# EAGLE design Adafruit ItsyBitsy RP2040 (EAGLE 9.6.2)
COMPANY: ADAFRUIT INDUSTRIES; DRAWN: KTOWN; REV: B
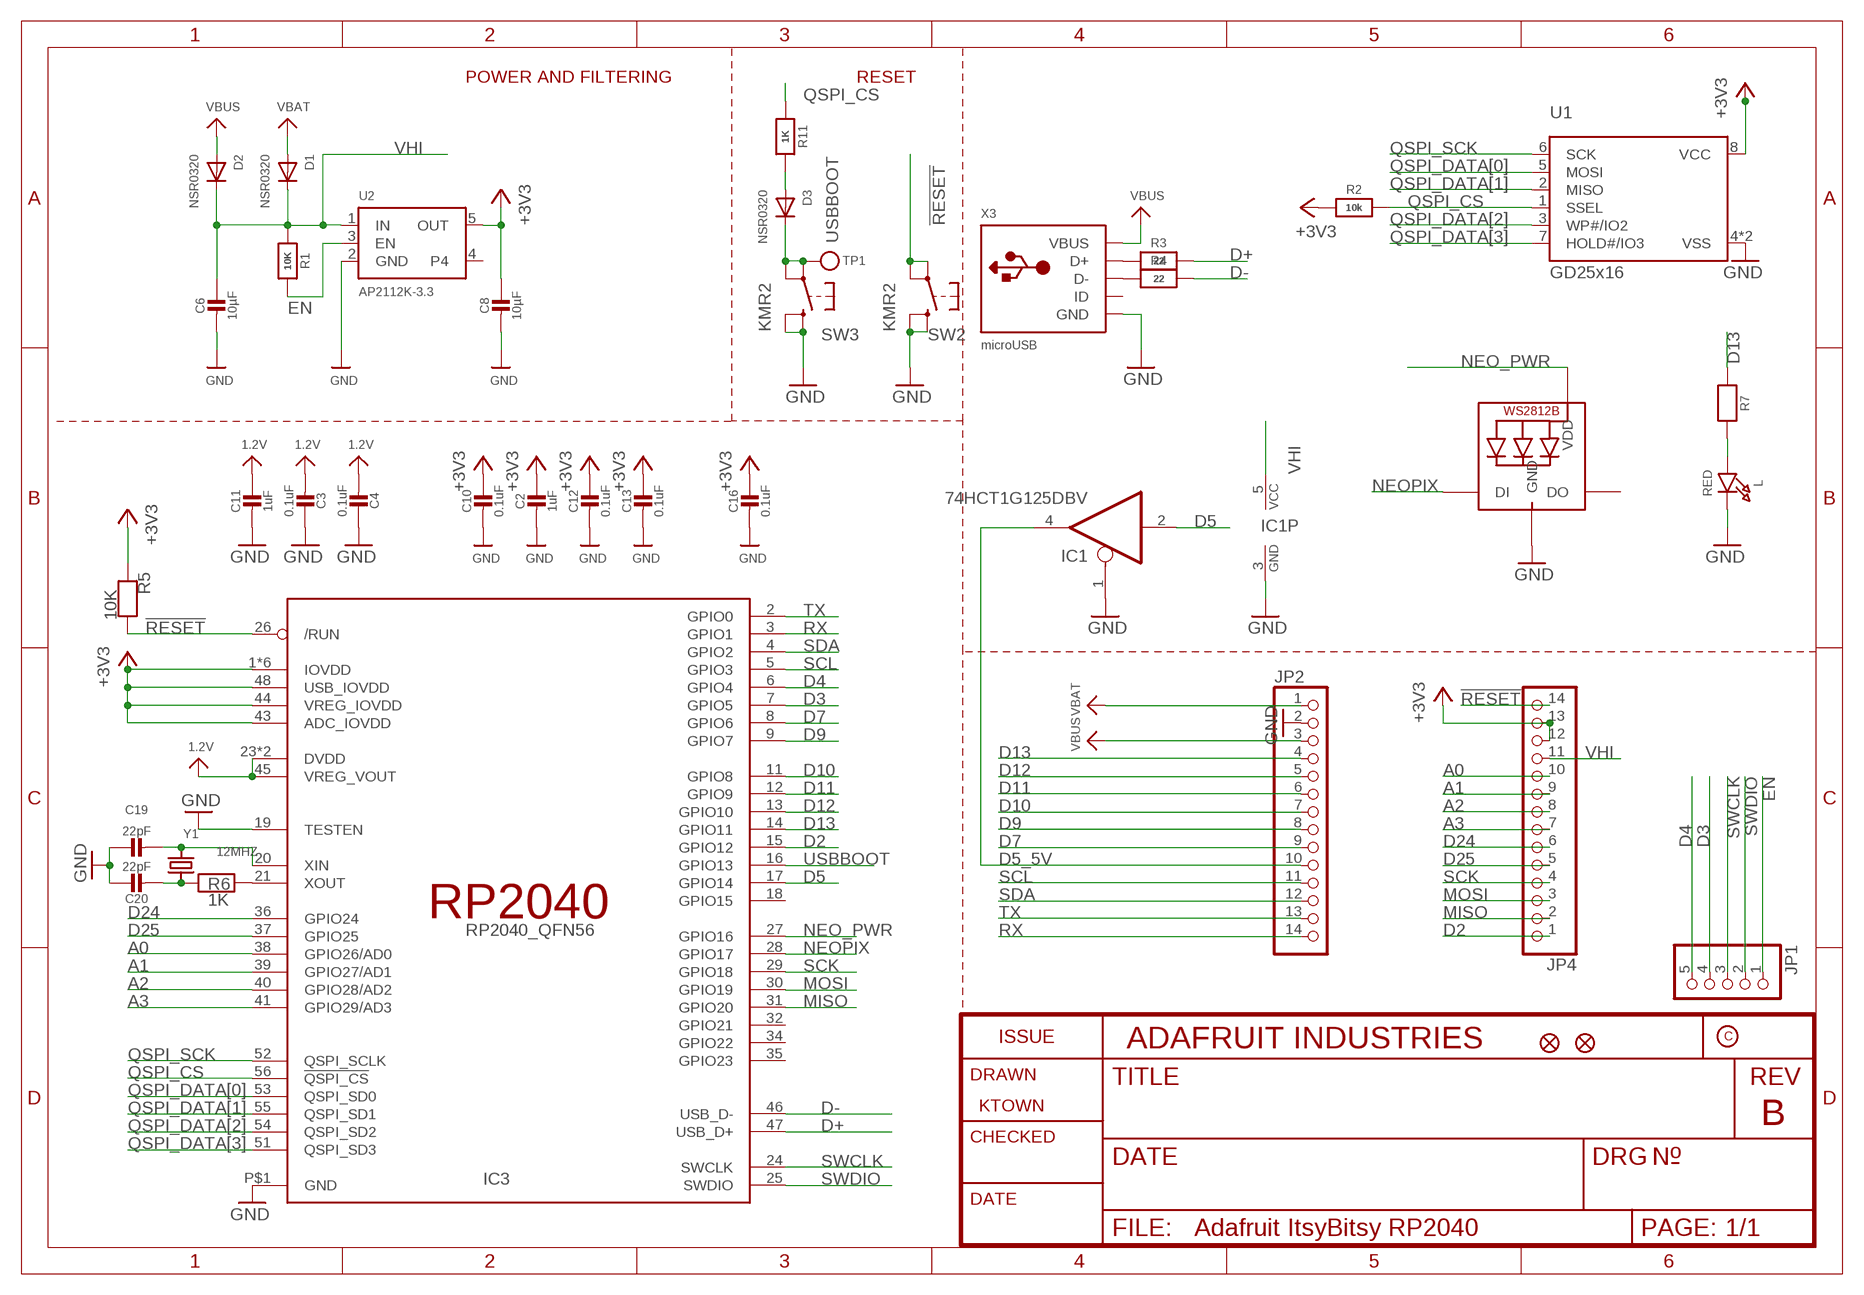
[diagram p0: schematic, sheet 1]

## Parts
C2  1uF  CAP_CERAMIC_0603MP  [_0603MP]
C3  0.1uF  CAP_CERAMIC_0402NO  [_0402NO]
C4  0.1uF  CAP_CERAMIC_0402NO  [_0402NO]
C6  10µF  CAP_CERAMIC0805-NOOUTLINE  [0805-NO]
C8  10µF  CAP_CERAMIC0805-NOOUTLINE  [0805-NO]
C10  0.1uF  CAP_CERAMIC_0402NO  [_0402NO]
C11  1uF  CAP_CERAMIC_0603MP  [_0603MP]
C12  0.1uF  CAP_CERAMIC_0402NO  [_0402NO]
C13  0.1uF  CAP_CERAMIC_0402NO  [_0402NO]
C16  0.1uF  CAP_CERAMIC_0402NO  [_0402NO]
C19  22pF  CAP_CERAMIC_0402NO  [_0402NO]
C20  22pF  CAP_CERAMIC_0402NO  [_0402NO]
D1  NSR0320  DIODESOD-323F  [SOD-323F]
D2  NSR0320  DIODESOD-323F  [SOD-323F]
D3  NSR0320  DIODESOD-323F  [SOD-323F]
IC1  74HCT1G125DBV  74AHC1G125DCK  [SC70-5]
IC3  RP2040_QFN56  [QFN56_7MM_REDUCEDEPAD]
JP1  HEADER-1X570MIL  [1X05_ROUND_70]
JP2  HEADER-1X14  [1X14_ROUND70]
JP4  HEADER-1X14  [1X14_ROUND70]
L  RED  LED0603_NOOUTLINE  [CHIPLED_0603_NOOUTLINE]
LED1  WS2812B_SK6805_1515  [SK6805_1515]
R1  10K  RESISTOR_0402NO  [_0402NO]
R2  10k  RESISTOR_0402NO  [_0402NO]
R3  22  RESISTOR_0402NO  [_0402NO]
R4  22  RESISTOR_0402NO  [_0402NO]
R5  10K  RESISTOR_0402NO  [_0402NO]
R6  1K  RESISTOR_0402NO  [_0402NO]
R7  1K  RESISTOR_0402NO  [_0402NO]
R11  1K  RESISTOR_0402NO  [_0402NO]
SW2  KMR2  SWITCH_TACT_SMT4.6X2.8  [BTN_KMR2_4.6X2.8]
SW3  KMR2  SWITCH_TACT_SMT4.6X2.8  [BTN_KMR2_4.6X2.8]
TP1  TESTPOINTROUND1.5MMNO  [TESTPOINT_ROUND_1.5MM_NO]
U1  GD25x16  SPIFLASH_8PIN_4X4  [USON8_4X4]
U2  AP2112K-3.3  VREG_SOT23-5  [SOT23-5]
U$34  FIDUCIAL_1MM  [FIDUCIAL_1MM]
U$35  FIDUCIAL_1MM  [FIDUCIAL_1MM]
X3  microUSB  USB_MICRO_NARROW  [4UCONN_20329_NARROW]
Y1  12MHZ  CRYSTAL2.5X2.0  [CRYSTAL_2.5X2]

## Nets
1.2V: C3.2 C4.2 C11.1 IC3.23(DVDD) IC3.45(VREG_VOUT) IC3.50(DVDD)
!RESET: IC3.26(/RUN) JP4.14 R5.2 SW2.A'(P1) SW2.A(P)
+3V3: C2.1 C8.1 C10.1 C12.1 C13.1 C16.1 IC3.1(IOVDD) IC3.10(IOVDD) IC3.22(IOVDD) IC3.33(IOVDD) IC3.42(IOVDD) IC3.43(ADC_IOVDD) IC3.44(VREG_IOVDD) IC3.48(USB_IOVDD) IC3.49(IOVDD) JP4.12 JP4.13 R2.1 R5.1 U1.8(VCC) U2.5(OUT)
A0: IC3.38(GPIO26/AD0) JP4.10
A1: IC3.39(GPIO27/AD1) JP4.9
A2: IC3.40(GPIO28/AD2) JP4.8
A3: IC3.41(GPIO29/AD3) JP4.7
D2: IC3.15(GPIO12) JP4.1
D3: IC3.7(GPIO5) JP1.4
D4: IC3.6(GPIO4) JP1.5
D5: IC1.2(I) IC3.17(GPIO14)
D5_5V: IC1.4(O) JP2.10
D7: IC3.8(GPIO6) JP2.9
D9: IC3.9(GPIO7) JP2.8
D10: IC3.11(GPIO8) JP2.7
D11: IC3.12(GPIO9) JP2.6
D12: IC3.13(GPIO10) JP2.5
D13: IC3.14(GPIO11) JP2.4 R7.1
D24: IC3.36(GPIO24) JP4.6
D25: IC3.37(GPIO25) JP4.5
D+: IC3.47(USB_D+) R3.2
D-: IC3.46(USB_D-) R4.2
EN: JP1.1 R1.2 U2.3(EN)
GND: C2.2 C3.1 C4.1 C6.2 C8.2 C10.2 C11.2 C12.2 C13.2 C16.2 C19.1 C20.1 IC1.1(OE) IC1.3(GND) IC3.19(TESTEN) IC3.P$1(GND) JP2.2 L.C LED1.4(GND) SW2.B'(S1) SW2.B(S) SW3.B'(S1) SW3.B(S) U1.4(VSS) U1.PAD(VSS) U2.2(GND) X3.BASE@1(GND) X3.BASE@2(GND) X3.GND X3.SPRT@1(GND) X3.SPRT@2(GND) X3.SPRT@3(GND) X3.SPRT@4(GND)
MISO: IC3.31(GPIO20) JP4.2
MOSI: IC3.30(GPIO19) JP4.3
N$1: R3.1 X3.D+
N$2: L.A R7.2
N$3: R4.1 X3.D-
N$4: D3.A R11.2
N$5: C19.2 IC3.20(XIN) Y1.3
N$6: C20.2 R6.1 Y1.1
N$7: IC3.21(XOUT) R6.2
NEO_PWR: IC3.27(GPIO16) LED1.2(VDD)
NEOPIX: IC3.28(GPIO17) LED1.1(DI)
QSPI_CS: IC3.56(!QSPI_CS) R2.2 R11.1 U1.1(SSEL)
QSPI_DATA[0]: IC3.53(QSPI_SD0) U1.5(MOSI)
QSPI_DATA[1]: IC3.55(QSPI_SD1) U1.2(MISO)
QSPI_DATA[2]: IC3.54(QSPI_SD2) U1.3(WP#/IO2)
QSPI_DATA[3]: IC3.51(QSPI_SD3) U1.7(HOLD#/IO3)
QSPI_SCK: IC3.52(QSPI_SCLK) U1.6(SCK)
RX: IC3.3(GPIO1) JP2.14
SCK: IC3.29(GPIO18) JP4.4
SCL: IC3.5(GPIO3) JP2.11
SDA: IC3.4(GPIO2) JP2.12
SWCLK: IC3.24(SWCLK) JP1.3
SWDIO: IC3.25(SWDIO) JP1.2
TX: IC3.2(GPIO0) JP2.13
USBBOOT: D3.C IC3.16(GPIO13) SW3.A'(P1) SW3.A(P) TP1.P$1
VBAT: D1.A JP2.1
VBUS: D2.A JP2.3 X3.VBUS
VHI: C6.1 D1.C D2.C IC1.5(VCC) JP4.11 R1.1 U2.1(IN)
Unconnected: IC3.18(GPIO15) IC3.32(GPIO21) IC3.34(GPIO22) IC3.35(GPIO23) LED1.3(DO) U2.4 X3.ID

## Notes on the sheet
- POWER AND FILTERING | RESET

## Library data of the parts
C2-C4 C6 C8 C10-C13 C16 C19 C20 = microbuilder:CAP_CERAMIC: Ceramic Capacitors For new designs, use the packages preceded by an '_' character since they are more reliable: The following footprints should be used on most boards: _0402 - Standard footprint for regular board layouts _0603 - Standard footprint for regular board layouts _0805 - Standard footprint for regular board layouts _1206 - Standard footprint for regular board layouts For extremely tight-pitch boards where space is at a premium, the following 'micro-pitch' footprints can be used (smaller pads, no silkscreen outline, etc.): _0402MP - Micro-pitch footprint for very dense/compact boards _0603MP - Micro-pitch footprint for very dense/compact boards _0805MP - Micro-pitch footprint for very dense/compact boards _1206MP - Micro-pitch footprint for very dense/compact boards
D1-D3 = adafruit:DIODE: Diode SMADIODE - SMA Surface Mount Package 20V 1A Schottky Diode Digikey: 641-1014-6-ND DO-1N4148 - Through Hole Small Current Diode SOD-123 20V 1 A (.5mV Vf) Schottky Diode - Digikey: MBRX120TPMSCT-ND SOD-323 10V 570mA (.38mV Vf, 3ns) Schottky Diode - Digikey: ZLLS410CT-ND SOD-523 30V 30mA Schottky Diode (RB751S-40TE61) - Digikey: RB751S-40TE61CT-ND SOT23-R/W - SOT23 Package (R = Solder Paste/Reflow Ovens, W = Hand-Soldering) BAT54Film 40V 300mA - Digikey: 497-7162-1-ND
IC1 = 74xx-little-us:74*1G125: Single Bus Buffer Gate with 3-State Output
IC3 = adafruit_micro:RP2040
JP1 = microbuilder:HEADER-1X5: PIN HEADER
JP2 JP4 = microbuilder:HEADER-1X14
L = microbuilder:LED: LED 0603 - 0603 Surface Mount Package 2mA: Green LED - Low Power (3.9mcd, 2ma, 1.7Vf) - Digikey: 475-2709-2-ND Orange LED - Low Power (9.8mcd, 2ma, 1.8Vf) - Digikey: 475-1194-2-ND Red LED - Low Power (5mcd, 2ma, 1.8Vf) - Digikey: 475-1195-2-ND Yellow LED - Low Power (7mcd, 2ma, 1.8Vf) - Digikey: 475-1196-2-ND 5mA: Blue LED - Low Power (17mcd, 5ma, 2.9Vf) - Digikey: LNJ937W8CRACT-ND 0805 - 0805 Surface Mount Package 2mA: Red LED (8.8mcd, 2mA, 1.8Vf, Clear) - Low Power [Digikey: 475-2510-1-ND] Green LED (5mcd, 2mA, 1.8Vf, Clear) - Low Power [Digikey: 475-2730-1-ND] Yellow LED (11.3mcd, 2mA, 1.8Vf, Clear) - Low Power [Digikey: 475-2555-1-ND] 20mA: Red LED (104mcd, 20mA, Diffused) - LS R976 [Digikey: 475-1278-6-ND] Red LED (12mcd, 20mA, 2.0Vf, Clear) - APT2012EC [Digikey: 754-1128-1-ND] Green LED (15mcd, 20mA, 2.2Vf, Clear) - APT2012GC [Digikey: 754-1131-1-ND] Orange LED (160mcd, 20mA, 2.1Vf, Clear) - APT2012SECK [Digikey: 754-1130-1-ND] 1206 - 1206 Surface Mount Package Green LED (26mcd, 20mA, Diffused) - LG N971 [Digikey: 475-1407-6-ND] Red LED (15mcd, 20mA, Diffused) - LH N974 [Digikey: 475-1416-6-ND] Cree - Cree High-Power Surface Mount LEDs XPEBWT-L1-0000-00D50 - White 111lm 350mA 2.9Vf 6200K 110° XTEAWT-00-0000-00000LEE3 - White 114lm 350mA 2.85Vf 5000K 115° Everlight - Everlight 45-21 Series Surface Mount LEDs 45-21/QK2C-B2832AC2CB2/2T - Warm White 2000mcd 20mA 3.25Vf 3050K 120° 45-21/LK2C-B38452C4CB2/2T - Nuetral White 2000mcd 20mA 3.25Vf 4150K 120° 45-21/LK2C-B50634C6CB2/2T - Cold White 2200mcd 20mA 3.25Vf 5650K 120° PLCC2 Reverse Mount LS T77K-J1L2-1-0-2-R18-Z - Red 11.25mcd 2mA 1.8Vf 630nm 120° LO T77K-L1M2-24-Z - Orange 19.6mcd 2mA 1.8Vf 606nm 120° LY T77K-K2M1-26-Z - Yellow 15.7mcd 2mA 1.8Vf 587nm 120°
LED1 = microbuilder:WS2812B
R1-R7 R11 = microbuilder:RESISTOR: Resistors For new designs, use the packages preceded by an '_' character since they are more reliable: The following footprints should be used on most boards: _0402 - Standard footprint for regular board layouts _0603 - Standard footprint for regular board layouts _0805 - Standard footprint for regular board layouts _1206 - Standard footprint for regular board layouts For extremely tight-pitch boards where space is at a premium, the following 'micro-pitch' footprints can be used (smaller pads, no silkscreen outline, etc.): _0402MP - Micro-pitch footprint for very dense/compact boards _0603MP - Micro-pitch footprint for very dense/compact boards _0805MP - Micro-pitch footprint for very dense/compact boards _1206MP - Micro-pitch footprint for very dense/compact boards
SW2 SW3 = microbuilder:SWITCH_TACT_SMT: SMT Tact Switches 6x6mm - Digikey: P12940SCT-ND KMR2 (4.6x2.8mm) - Digikey: 401-1426-1-ND EVQ-PQHB55 - Light Touch, 160GF (4.5x4.5mm) - Digikey: P8090SCT-ND KMT0 - KMT021 NGJ LHS (etc.) IP68/Waterproof - Digikey: CKN10289CT-ND
TP1 = microbuilder:TESTPOINT: Test Point Various test points for characterisation and PCB testing TESTPOINT_SMT - Compact Surface Mount Test Point [Digikey: 5016KTR-ND]
U1 = microbuilder:SPIFLASH_8PIN: SOIC8 SPI Flash Be careful with the size since SOIC8 flash comes in several 'widths' SOIC8 150 mil M25P16 - 16Mbit (2Mbit x 8) Serial Flash (75MHz SPI Bus), Supply: 2.7-3.6V Digikey: SOIC8 - M25P16-VMN6P-ND SOIC8 208 mil W25Q16BVSSIG - 16Mbit (2Mbit x 8) Serial Flash (104MHz SPI Bus), Supply: 2.7-3.6V Digikey: SOIC8 - W25Q16BVSSIG-ND
U2 = microbuilder:VREG_SOT23-5: SOT23-5 Fixed Voltage Regulators Part Current Out V Out V In V Dropout θJA (°C/W) TJ (°C) Digikey Part No. ADP121 150mA 3.3V 3.4-5.5V 0.09V @ 150mA -- -- ADP121-AUJZ33R7CT-ND ADP121 150mA 3.0V 3.1-5.5V 0.09V @ 150mA -- -- ADP121-AUJZ30R7CT-ND ADP122 300mA 3.3V 3.4-5.5V 0.085V @ 300mA -- -- ADP122AUJZ-3.3-R7CT-ND ADP1712 300mA 3.3V 3.5-5.5V 0.17V @ 300mA -- -- ADP1712AUJZ-3.3-R7TR-ND AP7311 (Low Cost) 150mA 3.3V 3.5-6V 0.15V @ 150mA -- -- AP7311-33WG-7DICT-ND LD39015M18R 150mA 1.8V 1.9V-5.5V 0.08V @ 100mA -- -- 497-6977-1-ND LP2985A-33DBVR 150mA 3.3V 3.3-16V 0.28V @ 150mA 206 150 296-18479-1-ND MCP1824T-3302E/OT 300mA 3.3V 3.5V-6V 0.2V @ 300mA -- -- MCP1824T-3302E/OTCT-ND MIC5205-2.5YM5 TR 150mA 2.5V 2.7-16V 0.165V @ 150mA -- -- 576-1257-2-ND MIC5205-3.0YM5 TR 150mA 3.0V 3.2V-16V 0.165V @ 150mA -- -- 576-1258-2-ND MIC5205-3.3YM5 TR 150mA 3.3V 3.5V-16V 0.165V @ 150mA -- -- 576-1259-2-ND TPS780330220 150mA 3.3V+2.2V 3.6-5.5V 250mV Max -- -- 296-23332-1-ND TDA3663/N1,135 100mA 3.3V 3.5-45V 0.18V @ 50mA -- -- 568-5343-1-ND Max operating temp can be calculated using θJA, TJ (max junction temperature), and power in watts. Set the "Maximum Ambient Temperature" until it reaches TJ ("Max Junction Temperature"), which is the absolute limit for safe use of the regulator: Heat Sink Temperature Calculator <http://www.daycounter.com/Calculators/Heat-Sink-Temperature-Calculator.phtml> For example, With 12V source into a 3.3V LP2985 and a 30mA load, we are dissipating (12V-3.3V) * 0.03A = 0.261W. With a θJA of 206 °C/W, a TJ of 150°C, and 261mW we can safely use the chip without a heat sink up to 75°C (=147.1°C Junction Temperature).
U$34 U$35 = microbuilder:FIDUCIAL: Fiducial Alignment Points Various fiducial points for machine vision alignment.; BOM: EXCLUDE
X3 = adafruit_connector:USB: USB Connectors USBMINIB - Surface Mount Female Mini-B USB Connector 4UConnector: 06564
Y1 = microbuilder:CRYSTAL: Crystals HC49UP - Surface Mount Crystal 4.0MHz 18pF +/-30ppm Surface Mount Crystal [Digikey: 535-9857-1-ND] 12.0 MHz Surface Mount Crystal [Digikey: 535-9869-6-ND] 25.0 MHz Surface Mount Crystal [Digikey: 535-9078-1-ND] 2.5 x 2.0mm - MEMs SMT Crystal 16.0 MHz 10pF 20ppm 2.5 x 2.0mm Crystal [Digikey -40-85°C: 535-10923-1-ND] 3.2 x 2.5mm - MEMs SMT Crystal 12.0 MHz 8pF 15ppm 3.2 x 2.5mm Crystal [Digikey: -10-70°C: 644-1047-1-ND -40-125°C: 644-1128-1-ND] 40~85°C cheaper: 644-1173-6-ND 16.0 MHz 8pF 15ppm 3.2 x 2.5mm Crystal [Digikey: -10-70°C: 644-1049-1-ND -40-125°C: 644-1129-2-ND]-40~85°C cheaper: 644-1175-6-ND 16.0 MHz 10pF 10ppm 3.2 x 2.5mm Crystal [Digikey: 644-1100-1-ND] 27.12 MHz 18pF 30ppm 3.2 x 2.5mm Crystal [Digikey: 887-1424-1-ND] 27.12MHz 10pF 10ppm 3.2 x 2.5mm Crystal [Digikey: 887-1329-1-ND] 4.9 x 1.8mm - MEMs SMT Crystal 32.768 KHz 12.5pF 20ppm 4.9 x 1.8mm Crystal [Digikey: SE2415CT-ND] 8.0 x 3.8mm - Surface Mount Crystal 32.768kHz 12.5pF 20ppm -40°C-85°C [Digikey: 535-9166-2-ND] Cylinder 32.768KHz Cylinder Crystal (2x6mm body) [Ex. Digikey: 300-8341-2-ND]

## Net classes
1 power: width 0.305 mm

## Board
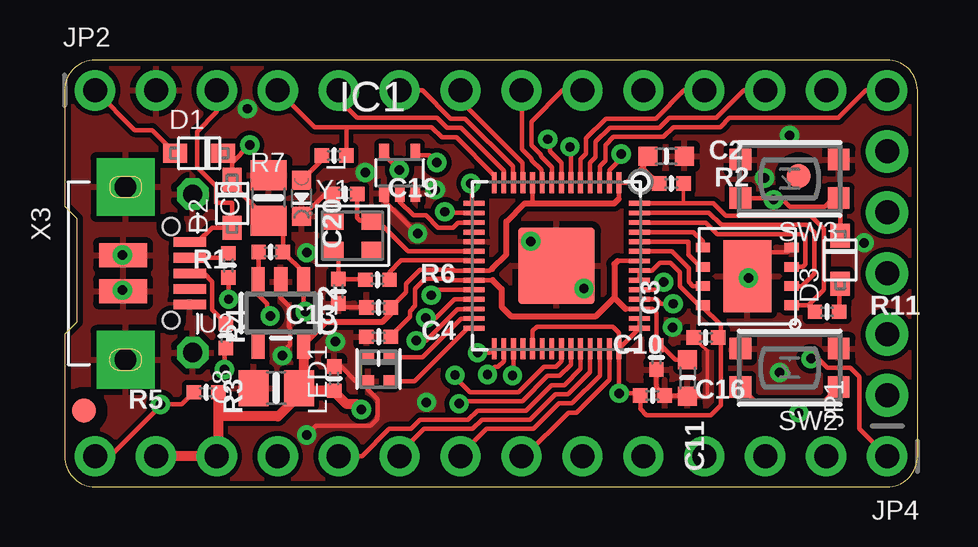
[diagram p1: board, top side]
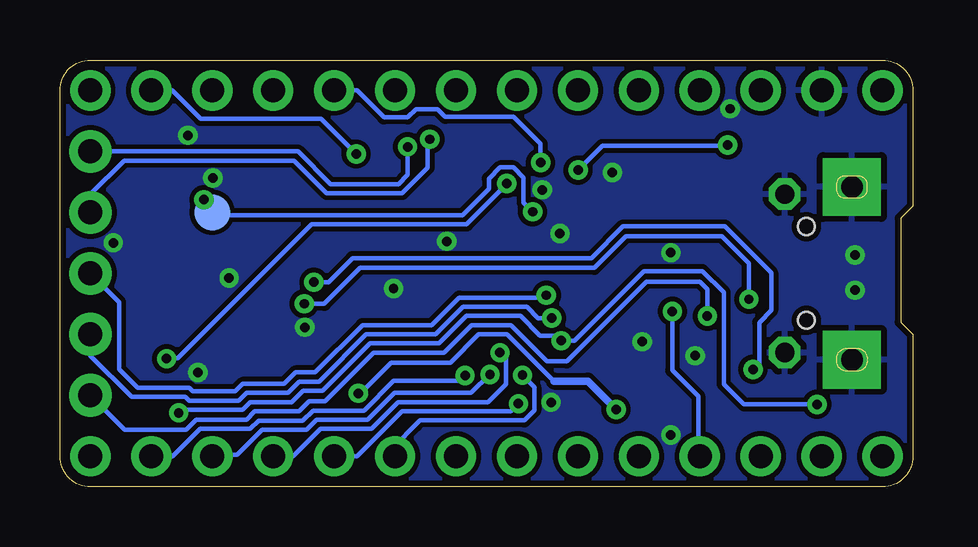
[diagram p2: board, bottom side, seen from below]

Size 35.56 x 17.78 mm. Coordinates in mm from the lower left corner, seen from the top.
Outline: 0,6.35 0,1.27 arc90 1.27,0 34.29,0 arc90 35.56,1.27 35.56,16.51 arc90 34.29,17.78 1.27,17.78 arc90 0,16.51 0,11.68 0.51,11.18 0.51,6.86 0,6.35
Copper layers (1*16): Top 0.035mm / dielectric 1.5mm / Bottom 0.035mm
Design rules "adafruit 7-7 *": minimum track width 6mil, minimum drill 15.5mil, track to track 8mil, track to pad 7mil, pad to pad 7mil, via to via 7mil, smd to smd 7mil, copper to edge 10mil, drill to drill 8mil, minimum pad ring 10mil, minimum via ring 8mil, stop-mask expansion 2mil, vias tented up to drill 20mil, thermal gap 10mil

### Footprints (pad centres in the part's own frame; a part is rotated, then mirrored left to right if it is on the bottom)
_0603MP = smd 0.8 x 0.8: 1 -0.762,0; 2 0.762,0
_0402NO = smd 0.6 x 0.6: 1 -0.508,0; 2 0.508,0
0805-NO = smd 1.24 x 1.5: 1 -0.95,0; 2 0.95,0
SOD-323F = smd 1 x 0.8: A -1,0; C 1,0
SC70-5 = smd 0.4 x 0.7: 1 -0.65,-0.85; 2 0,-0.85; 3 0.65,-0.85; 4 0.65,0.85; 5 -0.65,0.85
QFN56_7MM_REDUCEDEPAD = smd 0.875 x 0.2: 1 -3.45,2.6; 2 -3.45,2.2; 3 -3.45,1.8; 4 -3.45,1.4; 5 -3.45,1; 6 -3.45,0.6; 7 -3.45,0.2; 8 -3.45,-0.2; 9 -3.45,-0.6; 10 -3.45,-1; 11 -3.45,-1.4; 12 -3.45,-1.8; 13 -3.45,-2.2; 14 -3.45,-2.6; 29 3.45,-2.6; 30 3.45,-2.2; 31 3.45,-1.8; 32 3.45,-1.4; 33 3.45,-1; 34 3.45,-0.6; 35 3.45,-0.2; 36 3.45,0.2; 37 3.45,0.6; 38 3.45,1; 39 3.45,1.4; 40 3.45,1.8; 41 3.45,2.2; 42 3.45,2.6 | smd 0.2 x 0.875: 15 -2.6,-3.45; 16 -2.2,-3.45; 17 -1.8,-3.45; 18 -1.4,-3.45; 19 -1,-3.45; 20 -0.6,-3.45; 21 -0.2,-3.45; 22 0.2,-3.45; 23 0.6,-3.45; 24 1,-3.45; 25 1.4,-3.45; 26 1.8,-3.45; 27 2.2,-3.45; 28 2.6,-3.45; 43 2.6,3.45; 44 2.2,3.45; 45 1.8,3.45; 46 1.4,3.45; 47 1,3.45; 48 0.6,3.45; 49 0.2,3.45; 50 -0.2,3.45; 51 -0.6,3.45; 52 -1,3.45; 53 -1.4,3.45; 54 -1.8,3.45; 55 -2.2,3.45; 56 -2.6,3.45 | smd 3.2 x 3.2: P$1 0,0
1X05_ROUND_70 = drill 1 pad 1.778: 1 -5.08,0; 2 -2.54,0; 3 0,0; 4 2.54,0; 5 5.08,0
1X14_ROUND70 = drill 1 pad 1.676: 1 -16.51,0; 2 -13.97,0; 3 -11.43,0; 4 -8.89,0; 5 -6.35,0; 6 -3.81,0; 7 -1.27,0; 8 1.27,0; 9 3.81,0; 10 6.35,0; 11 8.89,0; 12 11.43,0; 13 13.97,0; 14 16.51,0
CHIPLED_0603_NOOUTLINE = smd 0.8 x 0.8: A 0,-0.75; C 0,0.75
SK6805_1515 = smd 0.5 x 0.5: 1 -0.5,-0.45; 2 0.5,-0.45; 3 0.5,0.45; 4 -0.5,0.45
BTN_KMR2_4.6X2.8 = smd 0.9 x 0.9: A 2.05,0.8; A' -2.05,0.8; B 2.05,-0.8; B' -2.05,-0.8
TESTPOINT_ROUND_1.5MM_NO = smd 1.5 x 1.5: P$1 0,0
USON8_4X4 = smd 0.6 x 0.4: 1 -1.85,1.2; 2 -1.85,0.4; 3 -1.85,-0.4; 4 -1.85,-1.2; 5 1.85,-1.2; 6 1.85,-0.4; 7 1.85,0.4; 8 1.85,1.2 | smd 2 x 3: PAD 0,0
SOT23-5 = smd 0.55 x 1.2: 1 -0.95,-1.3; 2 0,-1.3; 3 0.95,-1.3; 4 0.95,1.3; 5 -0.95,1.3
FIDUCIAL_1MM = smd 1 x 1: 1 0,0
4UCONN_20329_NARROW = smd 1 x 2: BASE@1 -0.75,-2; BASE@2 0.75,-2 | smd 0.4 x 1.35: D+ 0,0.775; D- -0.65,0.775; GND 1.3,0.775; ID 0.65,0.775; VBUS -1.3,0.775 | drill 0.8 pad 1.27 octagon: SPRT@1 -3.3,0.9; SPRT@2 3.3,0.9 | drill 0.9 pad 2.413 square: SPRT@3 -3.6,-1.9; SPRT@4 3.6,-1.9 | hole 0.7: -1.95,0; 1.95,0
CRYSTAL_2.5X2 = smd 0.9 x 0.75: 1 -0.825,-0.625; 2 0.825,-0.625; 3 0.825,0.625; 4 -0.825,0.625

### Placement (x,y rotation side)
C2  25.08,13.77 0 top
C3  24.68,5.38 90 top
C4  13.09,6.25 0 top
C6  8.51,12.03 90 top
C8  8.83,4.11 180 top
C10  26.73,6.22 180 top
C11  25.97,4.53 270 top
C12  11.24,4.51 90 top
C13  13.09,7.47 180 top
C16  24.51,3.8 0 top
C19  11.7,12.19 0 top
C20  11.42,8.14 90 top
D1  5.61,13.89 0 top
D2  6.99,11.8 90 top
D3  32.33,9.45 90 top
IC1  13.97,13.08 0 top
IC3  20.51,9.21 270 top
JP1  34.29,8.89 90 top
JP2  17.78,16.51 0 top
JP4  17.78,1.27 180 top
L  9.88,12.02 180 top
LED1  13.09,4.9 90 top
R1  8.6,9.78 180 top
R2  25.3,12.64 0 top
R3  6.73,6.29 270 top
R4  6.83,9.22 270 top
R5  5.91,3.94 180 top
R6  13.04,8.62 0 top
R7  11.24,13.8 180 top
R11  31.79,7.29 0 top
SW2  30.23,4.95 180 top
SW3  30.23,12.83 180 top
TP1  29.21,11.43 0 bottom
U1  28.46,8.76 180 top
U2  9.02,7.24 180 top
U$4  [ITSY2040_TOP]  0,0 0 top
U$5  [ITSY2040_BOT]  35.56,0 0 bottom
U$34  30.61,12.95 270 top
U$35  0.81,3.17 270 top
X3  4.45,8.89 270 top
Y1  12,10.46 0 top

### Tracks (layer width: path | path; a pad name or v marks a point on that pad's centre or on a via)
1.2V
  Top 0.152: IC3.45 24.31,7.41
  Top 0.178: IC3.50 23.06,9.41 | 23.39,7.41 IC3.45 | 17.85,8.61 IC3.23 16.09,8.61 16.04,8.66 15.03,8.66 14.62,8.26 14.62,7.53 14.39,7.3 14.39,7.09 13.6,6.3 C4.2 | 24.31,7.41 24.51,7.41 24.68,7.24 24.68,6.08 | 24.68,6.08 C3.2 | 24.68,6.08 25.46,5.3 C11.1
  Top 0.254: 23.06,9.41 22.92,9.27 22.92,7.87 | 22.92,7.87 23.39,7.41 | 22.92,7.87 22.16,7.11 18.61,7.11 18.22,7.49 18.22,8.23 17.85,8.61
!RESET  (via drill 0.39)
  Top 0.178: JP4.14 1.91,1.27 4,3.37 v4,3.43 4.89,3.43 R5.2 | IC3.26 17.04,7.39 16.38,7.39 15.07,6.08 v14.66,6.08 | 30.61,3.52 28.81,3.52 SW2.A | 30.61,3.52 31.64,3.52 SW2.A' | v30.61,3.08 30.61,3.52
  Bottom 0.178: v4,3.43 7.05,3.43 7.89,4.27 7.89,8.1 8.78,8.98 11.21,8.98 14.12,6.07 14.65,6.07 v14.66,6.08 14.88,6.3 15.54,6.3 16.36,7.12 18.6,7.12 19.75,5.97 22.64,5.97 24.61,4 25.42,4 25.9,3.52 27.63,3.52 27.94,3.21 30.48,3.21 v30.61,3.08
+3V3  (via drill 0.39)
  Top 0.152: R2.1 24.16,13.27 | C10.1 27.27,6.25 27.36,6.25
  Top 0.178: C8.1 9.78,4.19 9.97,4.19 | IC3.48 IC3.49 24.49,9.01 24.82,9.34 25.25,9.34 25.64,8.94 25.64,8.36 26.45,7.56 U1.8 26.61,7.49 27.36,6.74 27.36,6.25 27.36,3.39 26.95,2.98 24.26,2.98 24,3.24 C16.1 23.91,3.89 v23.12,3.89 23.11,3.9 IC3.42 | IC3.44 IC3.43 IC3.42 | 17.82,9.08 17.79,9.08 17.72,9.01 IC3.22 16.27,9.01 16.23,9.05 14.82,9.05 14.24,8.46 14.24,8.1 C13.1 | IC3.33 19.51,6.49 19.68,6.67 22.86,6.67 23.11,6.42 IC3.42 | 9.91,4 9.9,3.99 | 24.16,13.27 24.16,13.6 C2.1 24.32,13.55 23.43,12.66 IC3.1 23.11,12 | IC3.10 19.51,11.81
  Top 0.254: 9.9,3.99 C8.1 9.78,3.81 | 23.11,12 22.92,11.81 19.51,11.81 19.18,11.81 18.41,11.05 18.41,9.67 17.82,9.08 | C12.1 11.24,3.96 | 6.41,1.33 JP4.12 | C13.1 13.6,7.23 13.23,6.86 10.89,6.86 U2.5
  Top 0.406: JP4.12 JP4.13 | 11.24,3.96 11.76,3.44 12.15,3.44 v12.38,3.22 | R5.1 6.41,2.93 | 6.41,2.93 6.41,1.33 | 6.41,2.93 8.9,2.93 9.78,3.81 | U2.5 9.97,4.19 | C12.1 9.91,4
  Bottom 0.178: 14.96,4.4 16.91,6.35 18.1,6.35 19.28,5.17 21.75,5.17 23.03,3.89 v23.12,3.89
  Bottom 0.305: 14.96,4.4 13.56,4.4 v12.38,3.22
A0
  Top 0.178: JP4.10 12.39,1.27 13.54,2.41 14.44,2.41 14.82,2.79 16.83,2.79 17.21,3.17 19.24,3.17 20.3,4.23 20.84,4.23 21.51,4.91 IC3.38
A1
  Top 0.178: JP4.9 14.1,1.4 14.1,1.52 14.99,2.41 17.02,2.41 17.4,2.79 19.4,2.79 20.46,3.85 21,3.85 21.91,4.77 IC3.39
A2
  Top 0.178: JP4.8 16.64,1.4 16.64,1.46 17.59,2.41 19.56,2.41 20.61,3.47 21.15,3.47 22.31,4.63 IC3.40
A3
  Top 0.178: JP4.7 19.18,1.27 21,3.09 21.34,3.09 22.71,4.46 22.71,5.59 IC3.41
D2  (via drill 0.39)
  Top 0.178: v16.93,12.64 17,12.58 17,11.87 IC3.15 | JP4.1 33.13,2.43 33.13,4.57 32.75,4.95 31.8,4.95 31.42,5.33 v31.11,5.33
  Bottom 0.178: v16.93,12.64 16.93,12.61 18.61,10.93 25.07,10.93 30.66,5.35 31.1,5.35 v31.11,5.33
D3  (via drill 0.39)
  Top 0.178: IC3.7 20.71,13.5 20.23,13.98 20.23,14.39 v20.14,14.48
  Bottom 0.178: JP1.4 34.29,12.19 32.89,13.59 25.8,13.59 24.44,12.23 21.29,12.23 20.23,13.29 20.23,14.39 v20.14,14.48
D4  (via drill 0.39)
  Top 0.178: IC3.6 21.11,14.12 v21.07,14.16
  Bottom 0.178: v21.07,14.16 21.07,12.99 21.45,12.61 24.28,12.61 25.64,13.97 JP1.5
D5
  Top 0.178: IC1.2 13.97,11.87 14.54,11.3 15.06,11.3 15.58,10.79 16.19,10.79 16.41,11.01 IC3.17
D5_5V  (via drill 0.39)
  Top 0.178: v15.52,13.51 15.22,13.8 14.75,13.8 IC1.4
  Bottom 0.178: JP2.10 23.18,16.51 22.05,15.39 21.06,15.39 20.73,15.72 19.82,15.72 19.51,15.4 16.64,15.4 15.52,14.28 v15.52,13.51
D7
  Top 0.178: IC3.8 20.31,13.31 19.85,13.77 19.85,13.82 19.46,14.22 19.46,15.2 20.77,16.51 JP2.9
D9
  Top 0.178: IC3.9 19.89,12.68 19.89,13.18 19.88,13.2 19.88,13.21 19.47,13.61 19.47,13.66 19.07,14.06 19.07,16.48 JP2.8
D10
  Top 0.178: JP2.7 16.51,16.09 19.09,13.51 19.09,12.68 IC3.11
D11
  Top 0.178: IC3.12 18.69,12.68 18.69,13.34 16.69,15.34 16.09,15.34 14.92,16.51 JP2.6
D12
  Top 0.178: JP2.5 11.43,16.13 12.19,15.37 15.53,15.37 15.94,14.95 16.54,14.95 18.28,13.21 18.28,13.2 18.31,13.17 IC3.13
D13
  Top 0.178: JP2.4 10.41,14.99 11.11,14.99 11.24,14.99 11.75,14.99 | IC3.14 17.91,12.97 16.33,14.55 15.73,14.55 15.3,14.99 11.75,14.99 | R7.1 11.75,14.99
D24  (via drill 0.39)
  Top 0.178: IC3.36 20.71,5.23 20.48,5 19.98,5 18.93,3.94 16.91,3.94 16.28,4.57 v16.28,4.65
  Bottom 0.178: v16.28,4.65 15.78,4.15 15.78,3.19 16.2,2.76 20.54,2.76 20.73,2.57 21.59,1.71 JP4.6
D25  (via drill 0.39)
  Top 0.178: IC3.37 21.11,5.09 20.64,4.61 20.14,4.61 19.08,3.56 16.54,3.56 v16.45,3.46
  Bottom 0.178: v16.45,3.46 16.76,3.14 21.3,3.14 23.18,1.27 JP4.5
D+  (via drill 0.39)
  Top 0.178: v24.98,8.53 24.66,8.21 IC3.47 | R3.2 6.67,5.71 v6.67,4.89
  Bottom 0.178: v24.98,8.53 24.37,8.53 23.37,9.53 13.41,9.53 12.09,10.85 7.84,10.85 5.91,8.91 5.91,7.34 6.41,6.84 6.41,5.14 v6.67,4.89
D-  (via drill 0.39)
  Top 0.178: IC3.46 24.67,7.81 24.86,7.62 v25.38,7.62 | v6.84,7.81 v6.83,7.82 R4.2
  Bottom 0.178: v25.38,7.62 24.54,7.62 23.05,9.12 13.28,9.12 11.96,10.44 7.97,10.44 6.84,9.31 v6.84,7.81
EN  (via drill 0.39)
  Top 0.178: v8.57,7.11 8.45,7.11 8.45,7.62 8.07,8 U2.3 8.09,8.56 R1.2
  Bottom 0.178: JP1.1 32.85,2.38 30.3,2.38 29.88,2.79 27.79,2.79 27.44,3.14 25.59,3.14 25.18,3.56 24.51,3.56 22.48,5.59 19.56,5.59 18.41,6.73 16.76,6.73 15.25,5.23 14.43,5.23 11.11,8.54 8.88,8.54 8.57,8.24 v8.57,7.11
GND  (via drill 0.39)
  Top 0.152: C10.2 26.52,5.92 26.53,5.92 26.8,5.66 26.8,3.77 C11.2
  Top 0.178: IC1.1 13.32,11.91 14.68,10.55 v14.72,10.55 | C12.2 11.52,5.02 12.14,4.4 LED1.4 12.64,4.04 13.04,3.65 13.04,2.94 13.03,2.93 13.03,2.82 12.75,2.54 10.48,2.54 v10.1,2.16 | C20.1 11.58,7.47 C13.2 | v21.65,8.26 20.7,9.21 IC3.P$1 20.45,9.21 v19.43,10.22 | U2.2 9.02,7.86 9.37,7.51 9.37,6.64 9.4,6.6 9.4,5.91 9.08,5.59 v9.08,5.46 | L.C 9.93,11.27 10.86,12.19 C19.1 | U1.4 30.13,9.78 28.83,9.78 28.46,9.41 U1.PAD | C11.2 25.95,3.8 C16.2 24.68,4.14 C3.1
  other vias: 2.41,9.65 2.41,8.19 7.62,15.75 15.09,3.52 11.29,6.05 25.35,6.64 28.51,8.7 33.34,10.16 29.18,12.87 29.81,4.76 15.46,12.37 30.23,14.64 12.53,13.09 10.1,9.75
  pour Top: 0,0 35.56,0 35.56,17.78 0,17.78
  pour Bottom: 0,0 35.56,0 35.56,17.78 0,17.78
MISO  (via drill 0.39)
  Top 0.178: IC3.31 18.71,5.19 18.71,5.18 18.71,4.66 v18.67,4.63
  Bottom 0.178: JP4.2 30.86,1.27 29.72,2.41 27.63,2.41 27.29,2.76 25.44,2.76 25.02,3.17 22.89,3.17 21.65,4.41 18.89,4.41 v18.67,4.63
MOSI  (via drill 0.39)
  Top 0.178: IC3.30 18.31,5.23 18.08,5 17.95,5 v17.63,4.68
  Bottom 0.178: JP4.3 29.21,1.33 28.17,1.33 27.13,2.38 25.28,2.38 24.86,2.79 22.73,2.79 21.62,3.9 18.41,3.9 17.64,4.68 v17.63,4.68
N$1
  Top 0.178: X3.D+ 5.82,8.89 6.16,8.55 6.16,7.36 R3.1
N$2
  Top 0.178: R7.2 10.73,13.62 L.A
N$3
  Top 0.178: X3.D- 6.83,9.54 R4.1
N$4
  Top 0.178: R11.2 32.3,8.41 D3.A
N$5
  Top 0.178: IC3.20 14.33,9.81 13.08,11.05 12.86,11.05 Y1.3 12.32,11.09 12.21,11.2 C19.2
N$6
  Top 0.178: Y1.1 11.42,9.6 C20.2 12.51,8.65 R6.1
N$7
  Top 0.178: R6.2 13.55,8.94 14.03,9.43 17.04,9.43 IC3.21
NEO_PWR
  Top 0.178: IC3.27 16.53,7.01 14.93,5.4 LED1.2
NEOPIX
  Top 0.178: IC3.28 16.8,6.61 14.59,4.4 LED1.1
QSPI_CS
  Top 0.152: R2.2 25.81,11.81
  Top 0.178: IC3.56 25.81,11.81 27.05,11.81 27.56,11.29 31.1,11.29 31.65,10.74 31.65,8.2 31.01,7.56 | U1.1 31.01,7.56 | R11.1 31.01,7.56
QSPI_DATA[0]
  Top 0.178: IC3.53 26.22,10.61 26.61,10.22 U1.5
QSPI_DATA[1]
  Top 0.178: IC3.55 24.52,11.41 24.53,11.42 26.87,11.42 27.38,10.91 30.94,10.91 31.26,10.6 31.26,8.88 30.74,8.36 U1.2
QSPI_DATA[2]
  Top 0.178: IC3.54 26.74,11.01 27.22,10.53 30.79,10.53 30.88,10.44 30.88,9.27 30.77,9.16 U1.3
QSPI_DATA[3]
  Top 0.178: IC3.51 25.32,9.81 26.03,9.1 26.03,8.54 26.2,8.36 U1.7
QSPI_SCK
  Top 0.178: IC3.52 26,10.21 26,9.67 26.51,9.16 U1.6
RX
  Top 0.178: IC3.3 22.31,13.34 22.54,13.57 22.54,14.23 22.89,14.58 24.97,14.58 25.37,14.99 27.34,14.99 27.72,15.37 32.26,15.37 33.4,16.51 JP2.14
SCK  (via drill 0.39)
  Top 0.178: IC3.29 17.74,5.59 v17.22,5.59
  Bottom 0.178: JP4.4 25.84,1.27 24.7,2.41 22.57,2.41 21.46,3.52 17.72,3.52 16.96,4.28 16.96,5.33 v17.22,5.59
SCL
  Top 0.178: IC3.5 21.51,13.65 21.74,13.88 21.74,14.51 22.57,15.34 24.65,15.34 25.82,16.51 JP2.11
SDA
  Top 0.178: IC3.4 21.91,13.5 22.14,13.72 22.14,14.37 22.73,14.96 24.81,14.96 25.21,15.37 27.18,15.37 28.32,16.51 JP2.12
SWCLK  (via drill 0.39)
  Top 0.178: v15.29,7.98 15.52,8.21 IC3.24
  Bottom 0.178: JP1.3 33.1,7.7 33.1,4.9 32.32,4.13 30.18,4.13 30.02,3.97 28.26,3.97 27.94,4.29 26.21,4.29 25.74,4.76 24.92,4.76 22.95,6.73 20.07,6.73 18.92,7.88 15.39,7.88 v15.29,7.98
SWDIO  (via drill 0.39)
  Top 0.178: v15.06,7.03 15.47,7.03 16.25,7.81 IC3.25
  Bottom 0.178: v15.06,7.03 15.63,7.03 16.1,7.5 18.76,7.5 | 18.76,7.5 19.91,6.35 22.8,6.35 24.7,4.44 24.76,4.38 25.58,4.38 26.06,3.9 27.79,3.9 28.1,3.59 30.18,3.59 30.34,3.75 32.58,3.75 34.29,5.46 JP1.2 | 18.76,7.5
TX  (via drill 0.39)
  Top 0.178: IC3.2 22.71,13.19 23.04,13.52 23.04,13.7 v23.21,13.86
  Bottom 0.178: JP2.13 30.89,16.51 29.7,15.32 24.67,15.32 v23.21,13.86
USBBOOT  (via drill 0.39)
  Top 0.178: D3.C 32.33,11.97 SW3.A' 32.24,11.99 32,11.99 31.69,11.67 30.24,11.67 29.95,11.96 v29.56,11.96 29.49,12.03 SW3.A | v15.86,11.46 15.97,11.46 16.02,11.41 IC3.16
  Bottom 0.178: TP1.P$1 29.21,11.58 | 29.21,11.58 29.21,11.61 v29.56,11.96 | v15.86,11.46 16.24,11.84 16.24,12.88 16.66,13.3 17.21,13.3 17.68,12.84 17.68,12.41 18.77,11.31 28.94,11.31 29.21,11.58
VBAT
  Top 0.178: JP2.1 2.92,14.86 3.65,14.86 D1.A
VBUS
  Top 0.178: JP2.3 6.35,15.62 5.52,14.8 5.52,13.31 6.32,12.52 6.32,11.83 6.99,11.83 D2.A 6.15,10.8 5.54,10.19 X3.VBUS
VHI  (via drill 0.39)
  Top 0.178: D2.C 6.99,13.52 D1.C | D2.C 6.99,12.6 C6.1 9.11,10.48 R1.1 9.97,8.93 U2.1 9.97,7.37 v10.03,7.3 | v13.96,13.2 13.32,13.83 IC1.5 | D2.C 6.99,13.5 v7.72,14.24
  Bottom 0.178: v10.03,7.3 10.03,4.85 8.95,3.77 8.95,1.33 JP4.11 | v13.96,13.2 12.95,14.2 7.76,14.2 v7.72,14.24